# Altium schematic sheet LED.SchDoc
size A4
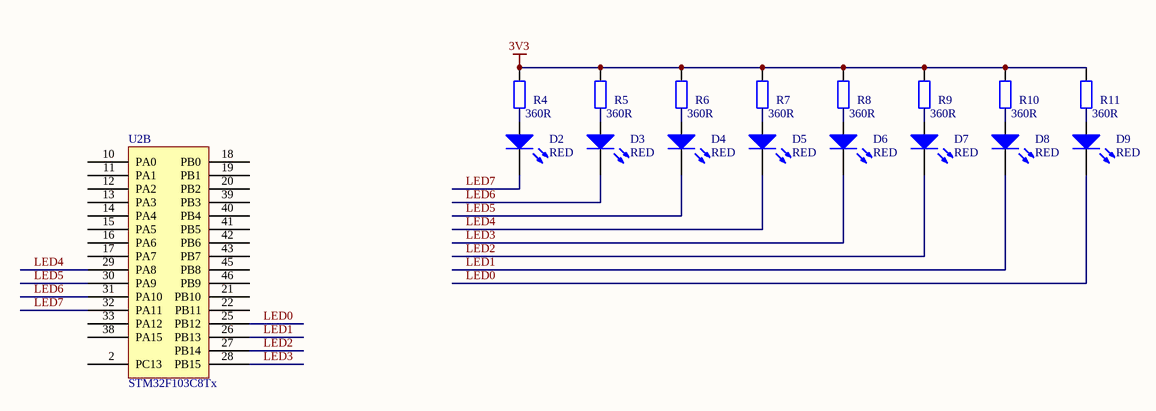
[diagram p0: LED.SchDoc]

## Parts
D2  RED  [LED0603-RED]
D3  RED  [LED0603-RED]
D4  RED  [LED0603-RED]
D5  RED  [LED0603-RED]
D6  RED  [LED0603-RED]
D7  RED  [LED0603-RED]
D8  RED  [LED0603-RED]
D9  RED  [LED0603-RED]
R4  value 360R  [R0603]
R5  value 360R  [R0603]
R6  value 360R  [R0603]
R7  value 360R  [R0603]
R8  value 360R  [R0603]
R9  value 360R  [R0603]
R10  value 360R  [R0603]
R11  value 360R  [R0603]
U2  STM32F103C8Tx  [PQFP48]  (part B of 2)

## Nets
3V3: R4.1 R5.1 R6.1 R7.1 R8.1 R9.1 R10.1 R11.1
LED0: D9.2(K) U2.25(PB12)
LED1: D8.2(K) U2.26(PB13)
LED2: D7.2(K) U2.27(PB14)
LED3: D6.2(K) U2.28(PB15)
LED4: D5.2(K) U2.29(PA8)
LED5: D4.2(K) U2.30(PA9)
LED6: D3.2(K) U2.31(PA10)
LED7: D2.2(K) U2.32(PA11)
NetD2_1: D2.1(A) R4.2
NetD3_1: D3.1(A) R5.2
NetD4_1: D4.1(A) R6.2
NetD5_1: D5.1(A) R7.2
NetD6_1: D6.1(A) R8.2
NetD7_1: D7.1(A) R9.2
NetD8_1: D8.1(A) R10.2
NetD9_1: D9.1(A) R11.2

Not connected (* = marked no-connect by the designer): U2 2(PC13) 10(PA0) 11(PA1) 12(PA2) 13(PA3) 14(PA4) 15(PA5) 16(PA6) 17(PA7) 18(PB0) 19(PB1) 20(PB2) 21(PB10) 22(PB11) 33(PA12) 38(PA15) 39(PB3) 40(PB4) 41(PB5) 42(PB6) 43(PB7) 45(PB8) 46(PB9)

## Library data of the parts
D2-D9 = LED0: Typical INFRARED GaAs LED; Published: 8-Jun-2000; LatestRevisionDate: 08-Jul-2005; LatestRevisionNote: Mech Layer 1 removed.; PackageReference: LED-0; Publisher: Altium Limited; PackageDescription: LED; 2 Leads
R4-R11 = Res2: Resistor; Published: 8-Jun-2000; LatestRevisionDate: 17-Jul-2002; LatestRevisionNote: Re-released for DXP Platform.; PackageReference: AXIAL-0.4; Publisher: Altium Limited; PackageDescription: Axial Device, Thru-Hole; 2 Leads; 0.4 in Pin Spacing